# EAGLE design Water Heater (EAGLE 9.6.2)
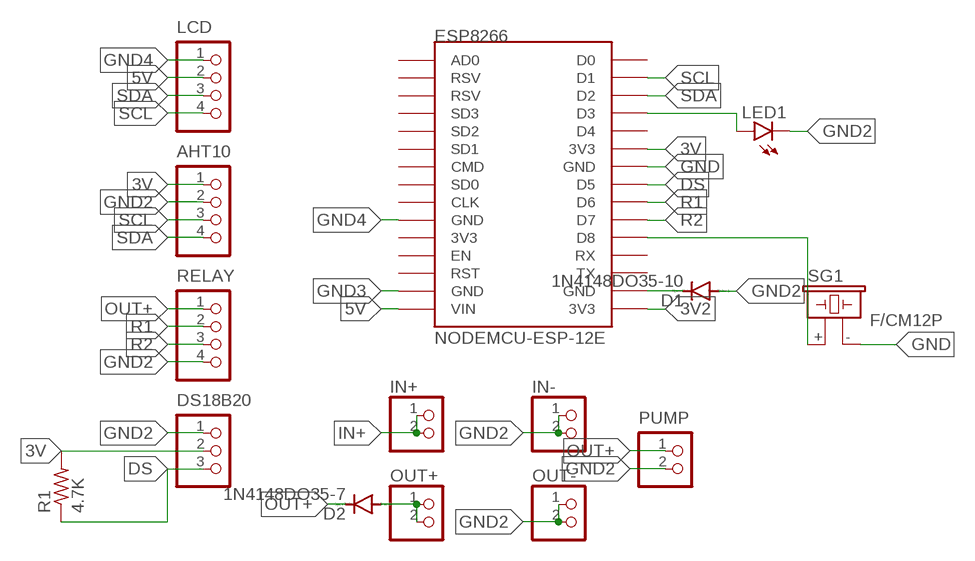
[diagram p0: schematic, sheet 1]

## Parts
AHT10  B4B-XH-A  [B4B-XH-A]
D1  1N4148DO35-10  [DO35-10]
D2  1N4148DO35-7  [DO35-7]
DS18B20  B3B-XH-A  [B3B-XH-A]
ESP8266  NODEMCU-ESP-12E  [NODEMCU-ESP-12E]
IN+  PINHD-1X2  [1X02]
IN-  PINHD-1X2  [1X02]
LCD  B4B-XH-A  [B4B-XH-A]
LED1  LED3MM  [LED3MM]
OUT+  PINHD-1X2  [1X02]
OUT-  PINHD-1X2  [1X02]
PUMP  B2B-XH-A  [B2B-XH-A]
R1  4.7K  R-US_0204/7  [0204/7]
RELAY  B4B-XH-A  [B4B-XH-A]
SG1  F/CM12P  [F/CM12P]

## Nets
3V: AHT10.1 DS18B20.2 ESP8266.3V3@1(3V3) R1.2
3V2: ESP8266.3V3@2(3V3)
5V: ESP8266.VIN LCD.2
DS: DS18B20.3 ESP8266.D5 R1.1
GND: ESP8266.GND@2(GND) SG1.-
GND2: AHT10.2 D1.A DS18B20.1 IN-.1 IN-.2 LED1.K(C) OUT-.1 OUT-.2 PUMP.2 RELAY.4
GND3: ESP8266.GND@1(GND)
GND4: ESP8266.GND@0(GND) LCD.1
IN+: IN+.1 IN+.2
N$2: ESP8266.D3 LED1.A
N$3: ESP8266.D8 SG1.+
N$4: D1.C ESP8266.GND@3(GND)
N$5: D2.A OUT+.1 OUT+.2
OUT+: D2.C PUMP.1 RELAY.1
R1: ESP8266.D6 RELAY.2
R2: ESP8266.D7 RELAY.3
SCL: AHT10.3 ESP8266.D1 LCD.4
SDA: AHT10.4 ESP8266.D2 LCD.3
Unconnected: ESP8266.3V3@0(3V3) ESP8266.AD0 ESP8266.CLK ESP8266.CMD ESP8266.D0 ESP8266.D4 ESP8266.EN ESP8266.RST ESP8266.RSV@0(RSV) ESP8266.RSV@1(RSV) ESP8266.RX ESP8266.SD0 ESP8266.SD1 ESP8266.SD2 ESP8266.SD3 ESP8266.TX

## Library data of the parts
AHT10 LCD RELAY = Jst-XH:B4B-XH-A: Wire-to-Board 2.5mm pitch top mount connector Source: http://www.jst-mfg.com/product/pdf/jpn/XH.pdf http://www.jst-mfg.com/product/detail.php?series=277
D1 D2 = diode:1N4148: DIODE high speed (Philips)
DS18B20 = Jst-XH:B3B-XH-A: Wire-to-Board 2.5mm pitch top mount connector Source: http://www.jst-mfg.com/product/pdf/jpn/XH.pdf http://www.jst-mfg.com/product/detail.php?series=277
ESP8266 = ESP8266_modules:NODEMCU-ESP-12E: ESP12E DEVKIT BOARD
IN+ IN- OUT+ OUT- = pinhead:PINHD-1X2: PIN HEADER
LED1 = led:LED: LED OSRAM: - CHIPLED LG R971, LG N971, LY N971, LG Q971, LY Q971, LO R971, LY R971 LH N974, LH R974 LS Q976, LO Q976, LY Q976 LO Q996 - Hyper CHIPLED LW Q18S LB Q993, LB Q99A, LB R99A - SideLED LS A670, LO A670, LY A670, LG A670, LP A670 LB A673, LV A673, LT A673, LW A673 LH A674 LY A675 LS A676, LA A676, LO A676, LY A676, LW A676 LS A679, LY A679, LG A679 - Hyper Micro SIDELED® LS Y876, LA Y876, LO Y876, LY Y876 LT Y87S - SmartLED LW L88C, LW L88S LB L89C, LB L89S, LG L890 LS L89K, LO L89K, LY L89K LS L896, LA L896, LO L896, LY L896 - TOPLED LS T670, LO T670, LY T670, LG T670, LP T670 LSG T670, LSP T670, LSY T670, LOP T670, LYG T670 LG T671, LOG T671, LSG T671 LB T673, LV T673, LT T673, LW T673 LH T674 LS T676, LA T676, LO T676, LY T676, LB T676, LH T676, LSB T676, LW T676 LB T67C, LV T67C, LT T67C, LS T67K, LO T67K, LY T67K, LW E67C LS E67B, LA E67B, LO E67B, LY E67B, LB E67C, LV E67C, LT E67C LW T67C LS T679, LY T679, LG T679 LS T770, LO T770, LY T770, LG T770, LP T770 LB T773, LV T773, LT T773, LW T773 LH T774 LS E675, LA E675, LY E675, LS T675 LS T776, LA T776, LO T776, LY T776, LB T776 LHGB T686 LT T68C, LB T68C - Hyper Mini TOPLED® LB M676 - Mini TOPLED Santana® LG M470 LS M47K, LO M47K, LY M47K Source: http://www.osram.convergy.de LUXEON: - LUMILED® LXK2-PW12-R00, LXK2-PW12-S00, LXK2-PW14-U00, LXK2-PW14-V00 LXK2-PM12-R00, LXK2-PM12-S00, LXK2-PM14-U00 LXK2-PE12-Q00, LXK2-PE12-R00, LXK2-PE12-S00, LXK2-PE14-T00, LXK2-PE14-U00 LXK2-PB12-K00, LXK2-PB12-L00, LXK2-PB12-M00, LXK2-PB14-N00, LXK2-PB14-P00, LXK2-PB14-Q00 LXK2-PR12-L00, LXK2-PR12-M00, LXK2-PR14-Q00, LXK2-PR14-R00 LXK2-PD12-Q00, LXK2-PD12-R00, LXK2-PD12-S00 LXK2-PH12-R00, LXK2-PH12-S00 LXK2-PL12-P00, LXK2-PL12-Q00, LXK2-PL12-R00 Source: www.luxeon.com KINGBRIGHT: KA-3528ASYC Source: www.kingbright.com
PUMP = Jst-XH:B2B-XH-A: Wire-to-Board 2.5mm pitch top mount connector Source: http://www.jst-mfg.com/product/pdf/jpn/XH.pdf http://www.jst-mfg.com/product/detail.php?series=277
R1 = resistor:R-US_: RESISTOR, American symbol
SG1 = buzzer:F/CM12P: BUZZER Source: Buerklin; OC_FARNELL: unknown; OC_NEWARK: unknown

## Board
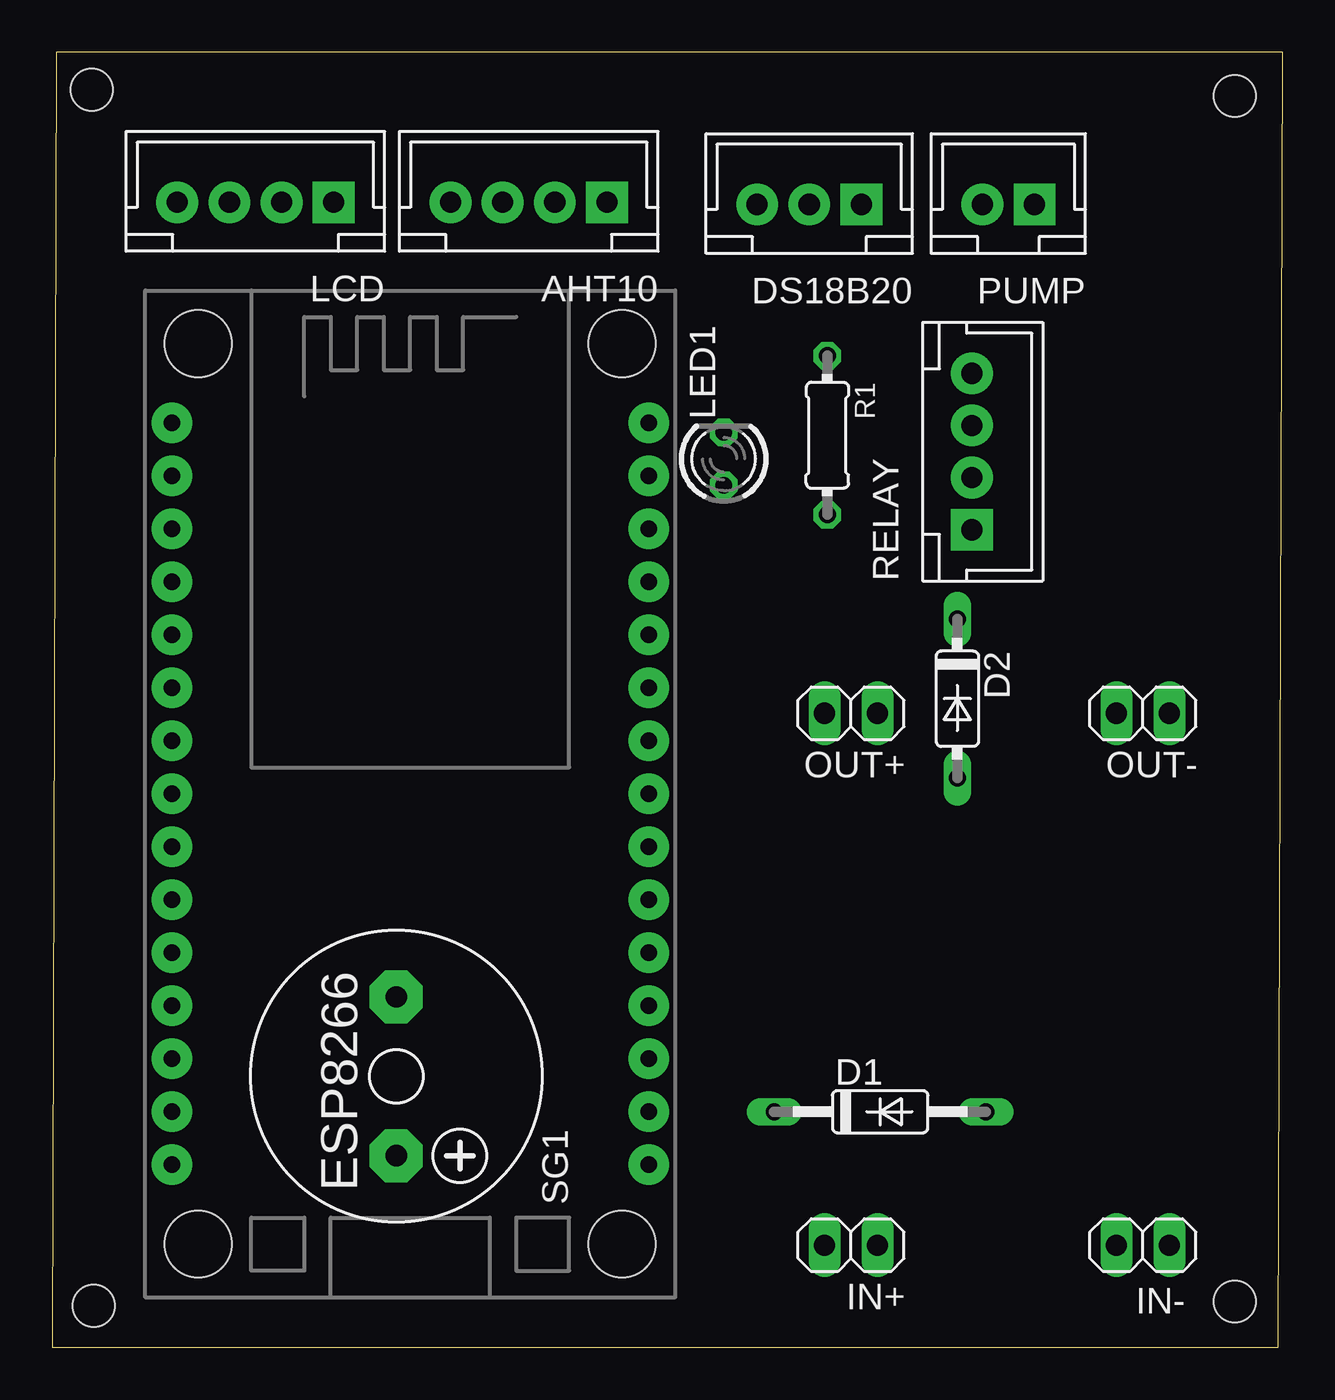
[diagram p1: board, top side]
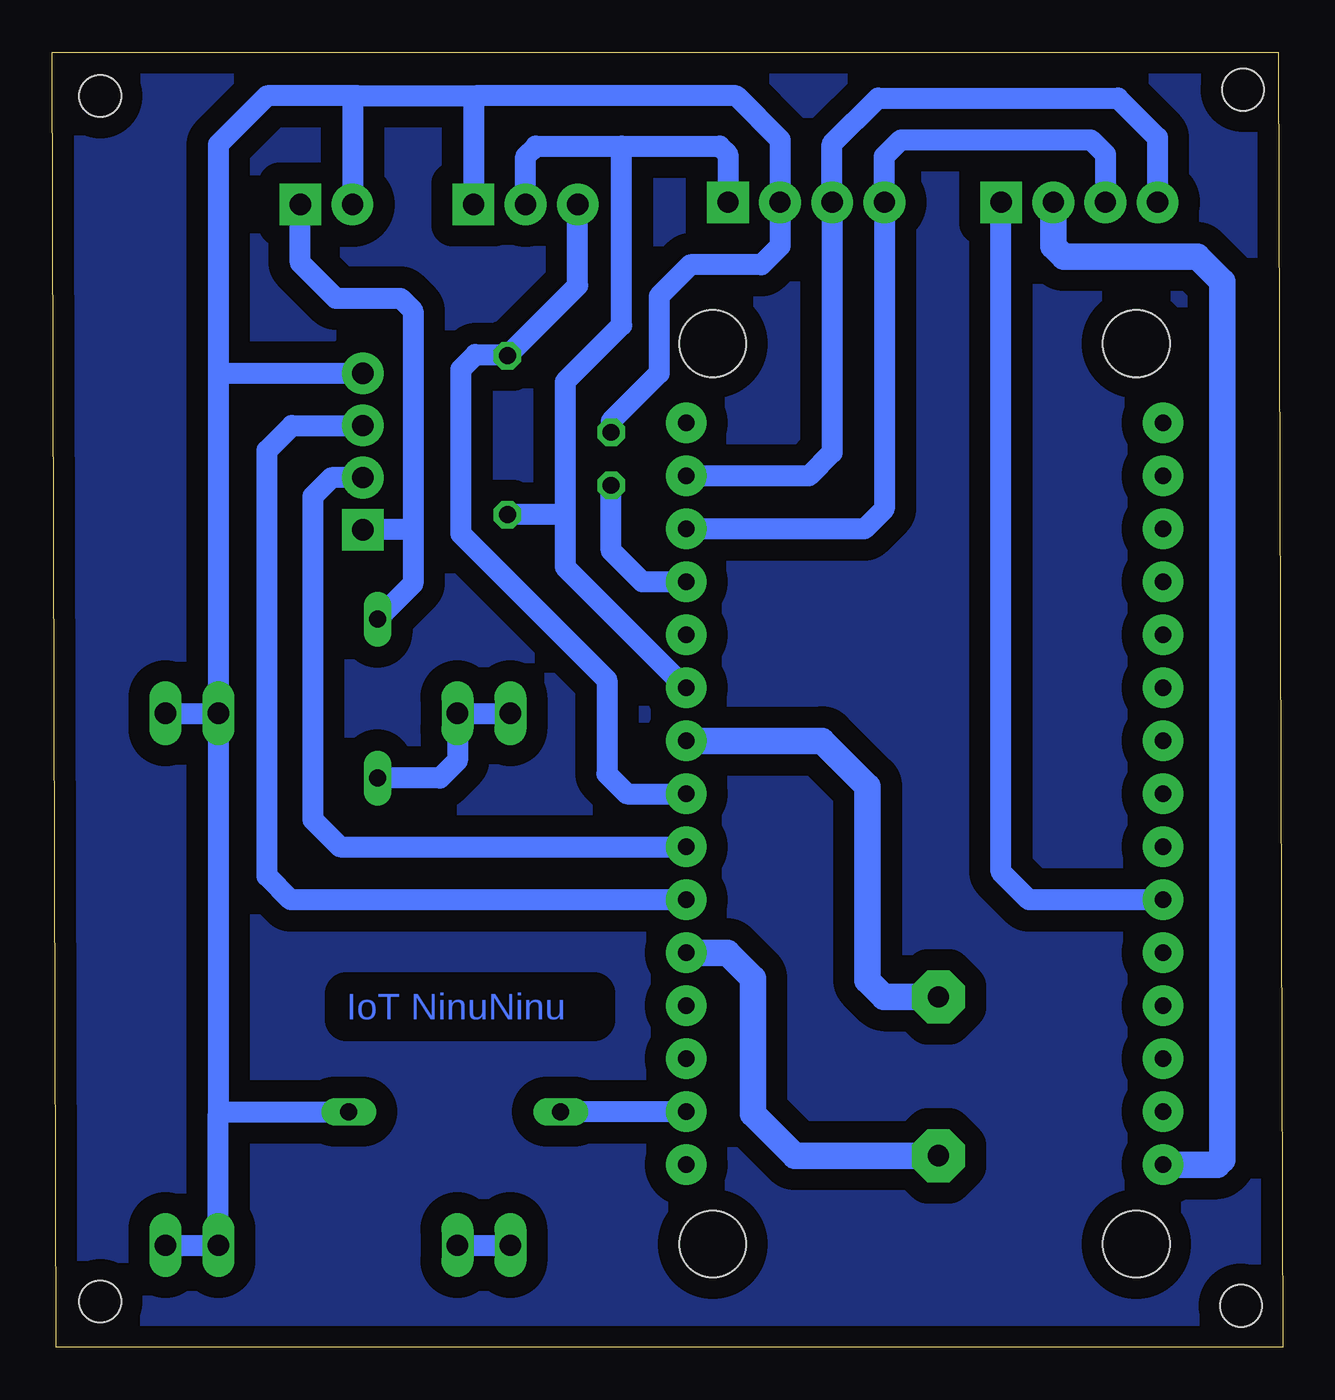
[diagram p2: board, bottom side, seen from below]

Size 59 x 62.1 mm. Coordinates in mm from the lower left corner, seen from the top.
Outline: 0,0 58.8,0 59,62.1 0.2,62.1 0,0
Copper layers (1*16): Top 0.035mm / dielectric 1.5mm / Bottom 0.035mm
Design rules "default *": minimum track width 6mil, minimum drill 0.35mm, track to track 40mil, track to pad 35mil, pad to pad 35mil, via to via 6mil, smd to smd 6mil, copper to edge 40mil, drill to drill 6mil, minimum pad ring 10mil, minimum via ring 8mil, stop-mask expansion 4mil, vias tented up to drill 0mil, thermal gap 10mil
Holes 2 mm at 2,2 1.9,60.3 56.7,60 56.7,2.2

### Footprints (pad centres in the part's own frame; a part is rotated, then mirrored left to right if it is on the bottom)
B4B-XH-A = drill 1.016 pad 2 square: 1 -3.75,0 | drill 1.016 pad 2: 2 -1.25,0; 3 1.25,0; 4 3.75,0
DO35-10 = drill 0.813 long: A 5.08,0; C -5.08,0
DO35-7 = drill 0.813 long: A 3.81,0; C -3.81,0
B3B-XH-A = drill 1.016 pad 2 square: 1 -2.5,0 | drill 1.016 pad 2: 2 0,0; 3 2.5,0
NODEMCU-ESP-12E = drill 0.8 pad 1.93: 3V3@0 -11.43,-7.62; 3V3@1 11.43,5.08; 3V3@2 11.43,-17.78; AD0 -11.43,17.78; CLK -11.43,-2.54; CMD -11.43,2.54; D0 11.43,17.78; D1 11.43,15.24; D2 11.43,12.7; D3 11.43,10.16; D4 11.43,7.62; D5 11.43,0; D6 11.43,-2.54; D7 11.43,-5.08; D8 11.43,-7.62; EN -11.43,-10.16; GND@0 -11.43,-5.08; GND@1 -11.43,-15.24; GND@2 11.43,2.54; GND@3 11.43,-15.24; RST -11.43,-12.7; RSV@0 -11.43,15.24; RSV@1 -11.43,12.7; RX 11.43,-10.16; SD0 -11.43,0; SD1 -11.43,5.08; SD2 -11.43,7.62; SD3 -11.43,10.16; TX 11.43,-12.7; VIN -11.43,-17.78 | hole 3.2: -10.16,21.59; 10.16,21.59; 10.16,-21.59; -10.16,-21.59
1X02 = drill 1.016 long: 1 -1.27,0; 2 1.27,0
LED3MM = drill 0.813 octagon: A -1.27,0; K 1.27,0
B2B-XH-A = drill 1.016 pad 2 square: 1 -1.25,0 | drill 1.016 pad 2: 2 1.25,0
0204/7 = drill 0.813 octagon: 1 -3.81,0; 2 3.81,0
F/CM12P = drill 1.016 pad 2.54 octagon: + 3.81,0; - -3.81,0

### Placement (x,y rotation side)
AHT10  22.85,54.9 180 top
D1  39.7,11.3 0 top
D2  43.4,31.1 270 top
DS18B20  36.3,54.8 180 top
ESP8266  17.17,26.54 0 top
IN+  38.3,4.9 180 top
IN-  52.3,4.9 180 top
LCD  9.75,54.9 180 top
LED1  32.2,42.6 90 top
OUT+  38.3,30.4 180 top
OUT-  52.3,30.4 180 top
PUMP  45.85,54.8 180 top
R1  37.17,43.73 270 top
RELAY  44.1,42.95 90 top
SG1  16.5,13 270 top

### Tracks (layer width: path | path; a pad name or v marks a point on that pad's centre or on a via)
3V
  Bottom 1.016: 36.2,54.7 DS18B20.2 36.3,57.1 35.8,57.6 31.7,57.6 | 31.7,57.6 27,57.6 26.6,57.2 AHT10.1 | 31.7,57.6 31.7,49 34.4,46.3 34.4,39.9 | ESP8266.3V3@1 34.4,37.42 34.4,39.9 | 34.4,39.9 34.42,39.92 R1.2
5V
  Bottom 1.27: ESP8266.VIN 3.14,8.76 2.9,9 2.9,51.1 4.1,52.3 10.5,52.3 11,52.8 LCD.2
DS
  Bottom 1.016: ESP8266.D5 31.44,26.54 32.4,27.5 32.4,32 39.4,39 39.4,46.9 38.7,47.6 37.23,47.6 R1.1 33.8,50.91 DS18B20.3
GND
  Bottom 1.27: ESP8266.GND@2 22.08,29.08 19.9,26.9 19.9,17.6 19.11,16.81 SG1.-
GND2
  Bottom 1.016: OUT-.1 OUT-.2 | LED1.K 32.2,44.4 29.9,46.7 29.9,50.4 28.4,51.9 25,51.9 24.1,52.8 AHT10.2 24.1,57.9 26.2,60 38.7,60 | OUT-.2 51.03,11.2 | 51.03,11.2 IN-.2 IN-.1 | 44.3,60 48.7,60 51.03,57.67 51.03,46.8 | 44.3,60 38.7,60 | 44.3,60 44.6,59.7 PUMP.2 | 38.7,60 38.8,59.9 DS18B20.1 | 51.03,46.8 OUT-.2 | 51.03,46.8 50.93,46.7 RELAY.4 | 51.03,11.2 50.93,11.3 D1.A
GND4
  Bottom 1.016: ESP8266.GND@0 12.16,21.46 13.5,22.8 LCD.1
IN+
  Bottom 1.016: IN+.1 IN+.2
N$1
  pour Bottom: 0.2,61.8 58.5,61.8 58.6,61.9 58.6,0.1 58.4,-0.1 0,-0.1
N$2
  Bottom 1.016: ESP8266.D3 30.7,36.7 32.2,38.2 LED1.A
N$3
  Bottom 1.27: SG1.+ 23.39,9.19 25.4,11.2 25.4,17.7 26.62,18.92 ESP8266.D8
N$4
  Bottom 1.016: ESP8266.GND@3 D1.C
N$5
  Bottom 1.016: D2.A 40.41,27.29 39.57,28.13 OUT+.1 OUT+.2
OUT+
  Bottom 1.016: PUMP.1 47.1,52 45.4,50.3 42.3,50.3 41.7,49.7 41.7,39.2 | D2.C 41.7,36.61 41.7,39.2 | 41.7,39.2 RELAY.1
R1
  Bottom 1.016: RELAY.2 45.6,41.7 46.5,40.8 46.5,25.3 45.2,24 ESP8266.D6
R2
  Bottom 1.016: ESP8266.D7 47.56,21.46 48.7,22.6 48.7,43 47.5,44.2 RELAY.3
SCL
  Bottom 1.016: LCD.4 6,58 7.9,59.9 19.4,59.9 21.6,57.7 AHT10.3 21.6,42.9 22.72,41.78 ESP8266.D1
SDA
  Bottom 1.016: LCD.3 8.5,57.2 9.2,57.9 18.3,57.9 19.1,57.1 AHT10.4 19.1,40.2 20.06,39.24 ESP8266.D2

### Text on the board
Bottom: IoT NinuNinu